# Altium schematic sheet Power.SchDoc
size 279 x 248 mm
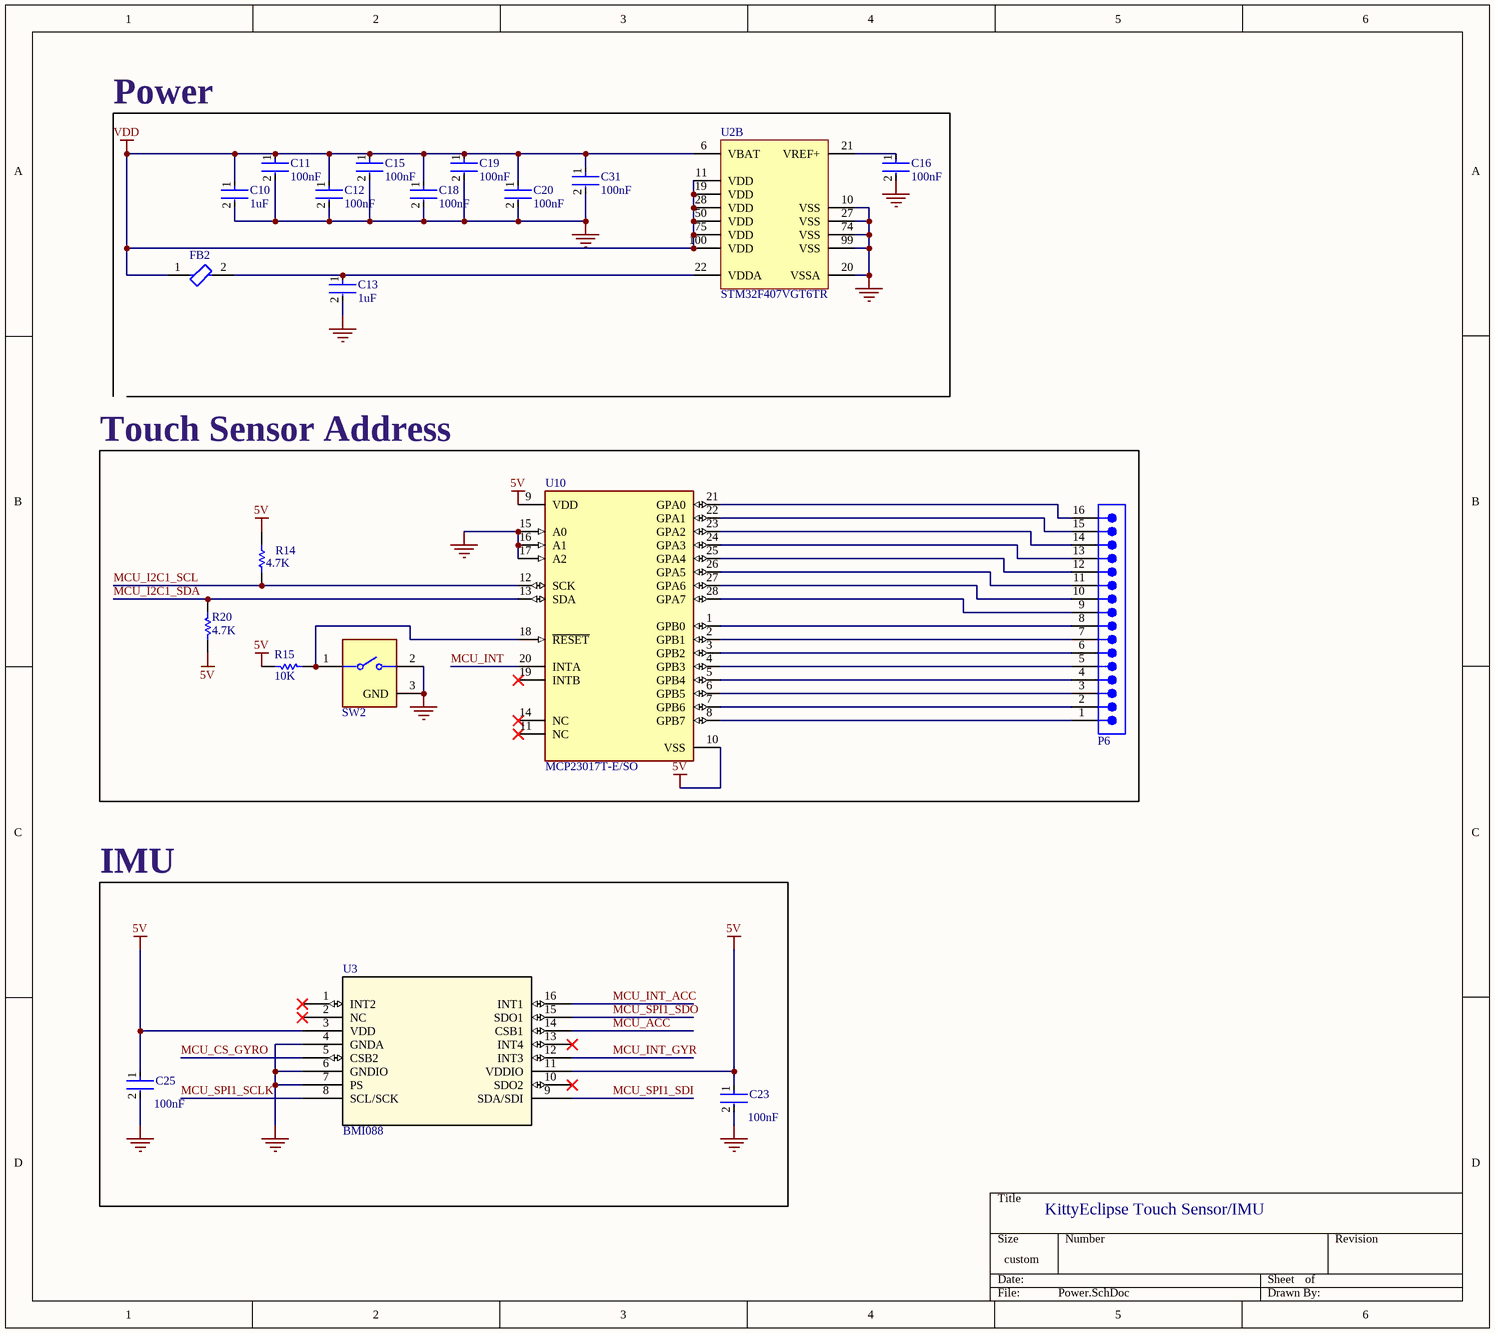
[diagram p0: Power.SchDoc]

## Parts
C10  1uF  [FP-CL10-IPC_C]
C11  100nF  [FP-CL93-IPC_C]
C12  100nF  [FP-CL93-IPC_C]
C13  1uF  [FP-CL10-IPC_C]
C15  100nF  [FP-CL93-IPC_C]
C16  100nF  [FP-CL93-IPC_C]
C18  100nF  [FP-CL93-IPC_C]
C19  100nF  [FP-CL93-IPC_C]
C20  100nF  [FP-CL93-IPC_C]
C23  100nF  [FP-CL93-IPC_C]
C25  100nF  [FP-CL93-IPC_C]
C31  100nF  [FP-CL93-IPC_C]
FB2  600ohm  [FP-BLM15-0_05-MFG]  (value not drawn)
P6  61301611121  [61301611121]  (value not drawn)
R14  4.7K  [RESC1608X55X25LL10T15]
R15  10K  [RESC1608X55X25ML10T15]
R20  4.7K  [RESC1608X55X25LL10T15]
SW2  B3U-1100PM  [FP-B3U-1100PM-MFG]  (value not drawn)
U2  STM32F407VGT6TR  [STM-LQFP100_L]  (part B of 2)
U3  BMI088  [QFN_BMI085_BOS]
U10  MCP23017T-E/SO  [FP-C04-052-MFG]

## Blocks framed on the sheet
Touch Sensor Address: P6 R14 R15 R20 SW2 U10
IMU: C23 C25 U3

## Nets
5V: C23.1 C25.1 R14.1 R15.1 R20.1 U3.3(VDD) U3.11(VDDIO) U10.9(VDD) U10.10(VSS)
GND: C10.2 C11.2 C12.2 C13.2 C15.2 C16.2 C18.2 C19.2 C20.2 C23.2 C25.2 C31.2 SW2.2 SW2.3(GND) U2.10(VSS) U2.20(VSSA) U2.27(VSS) U2.74(VSS) U2.99(VSS) U3.4(GNDA) U3.6(GNDIO) U3.7(PS) U10.15(A0) U10.16(A1) U10.17(A2)
VDD: C10.1 C11.1 C12.1 C15.1 C18.1 C19.1 C20.1 C31.1 FB2.1 U2.6(VBAT) U2.11(VDD) U2.19(VDD) U2.28(VDD) U2.50(VDD) U2.75(VDD) U2.100(VDD)
MCU_ACC: U3.14(CSB1)
MCU_CS_GYRO: U3.5(CSB2)
MCU_I2C1_SCL: R14.2 U10.12(SCK)
MCU_I2C1_SDA: R20.2 U10.13(SDA)
MCU_INT: U10.20(INTA)
MCU_INT_ACC: U3.16(INT1)
MCU_INT_GYR: U3.12(INT3)
MCU_SPI1_SCLK: U3.8(SCL/SCK)
MCU_SPI1_SDI: U3.9(SDA/SDI)
MCU_SPI1_SDO: U3.15(SDO1)
NetC13_1: C13.1 FB2.2 U2.22(VDDA)
NetC16_1: C16.1 U2.21(VREF+)
NetP6_1: P6.1 U10.8(GPB7)
NetP6_2: P6.2 U10.7(GPB6)
NetP6_3: P6.3 U10.6(GPB5)
NetP6_4: P6.4 U10.5(GPB4)
NetP6_5: P6.5 U10.4(GPB3)
NetP6_6: P6.6 U10.3(GPB2)
NetP6_7: P6.7 U10.2(GPB1)
NetP6_8: P6.8 U10.1(GPB0)
NetP6_9: P6.9 U10.28(GPA7)
NetP6_10: P6.10 U10.27(GPA6)
NetP6_11: P6.11 U10.26(GPA5)
NetP6_12: P6.12 U10.25(GPA4)
NetP6_13: P6.13 U10.24(GPA3)
NetP6_14: P6.14 U10.23(GPA2)
NetP6_15: P6.15 U10.22(GPA1)
NetP6_16: P6.16 U10.21(GPA0)
NetR15_2: R15.2 SW2.1 U10.18(~{RESET})

Not connected (* = marked no-connect by the designer): U3 1(INT2)* 2(NC)* 10(SDO2)* 13(INT4)*; U10 11(NC)* 14(NC)* 19(INTB)*

## Notes on the sheet
- Power
- KittyEclipse Touch Sensor/IMU

## Library data of the parts
C10 C13 = CMP-2000-06094-2: Cap Ceramic 1uF 10V X7R ±10% Pad SMD 0603 +125°C T/R; Packaging: Tape and Reel; Depth: 0.8mm; Voltage Rating: 10V; Lead Free: Lead Free; Radiation Hardening: No; Capacitance: 1uF; Length: 1.6mm; Package Quantity: 1; Mount: Surface Mount; Case/Package: 0603; Max Operating Temperature: 125°C; Case Code (Metric): 1608; Height: 0.8mm; Min Operating Temperature: -55°C; Dielectric: X7R; Contact Plating: Tin; Case Code (Imperial): 0603; Thickness: 0.035inch; Voltage Rating (DC): 10V; Tolerance: 10%; Width: 0.031inch
C11 C12 C15 C16 C18-C20 C23 C25 C31 = CMP-13271-000610-1: Cap Ceramic 100nF 10V X7R ±10% SMD 0402 +125°C Paper T/R
FB2 = CMP-0686-00187-4: Chip Ferrite Bead, 0402, 600Ω @ 100MHz, 0.52Ω, 25%, 300mA; DC Resistance-Max: 600mR; Number of Lines: 1; DC Resistance (DCR): 520mR; Shielding: Unshielded; Impedance: 600R; Material: Steel; Frequency: 100MHz; Lead Free: Lead Free; Max DC Current: 300mA; Test Frequency: 100MHz; Depth: 0.55mm; Length: 1mm; Case Code (Imperial): 0402; Packaging: Tape and Reel; Height: 0.5mm; Max Operating Temperature: 125°C; Military Standard: Not; REACH SVHC: No SVHC; Case Code (Metric): 1005; Series: BLM15AG_SN; Core Material: Ferrite; Termination: SMD/SMT; DC Current: 300mA; Package Quantity: 10000; Width: 0.5mm; RoHS Compliant: Yes; Min Operating Temperature: -55°C; Current Rating: 300mA; Case/Package: 0402; Number of Pins: 2; Radiation Hardening: No; Tolerance: 25%; Number of Circuits: 1; Max Current Rating: 300mA
P6 = CMP-1502-01095-4: NexarPartId: 32855548; Voltage Rating: 250V; Connector Type: Male Pin; Current Rating: 3A; Contact Resistance: 20mΩ; Number of Contacts: 16; Gender: Male; Pitch: 2.54mm; Min Operating Temperature: -40°C; Termination: Solder; Height: 8.89mm; Contact Plating: Gold; Packaging: Bulk; Contact Material: Copper; Mount: Through Hole; Number of Rows: 1; Contact Mating Length: 5.9944mm; Operating Supply Voltage: 250V; RoHS: Compliant; Max Operating Temperature: 105°C; Lead Pitch: 2.54mm; Color: Black; Number of Pins: 16; Number of Positions: 16; REACH SVHC: Unknown; Orientation: Vertical
R14 R20 = CMP-2000-06942-1: Chip Resistor, 4.7 KOhm, +/- 1%, 0.1 W, -55 to 155 degC, 0603 (1608 Metric), RoHS, Tape and Reel; Manufacturer: Yageo; Power Rating: 100mW; Temperature Coefficient: 100PPM/C; Resistance: 4.7kOhms; Voltage Rating: 50V; Package Reference: 0603; Series: RC; Datasheet Version: Rev. 7, 05/2017; Packaging: Reel; Termination Style: SMD/SMT; Datasheet URL: http://www.yageo.com/documents/recent/PYu-RC_Group_51_RoHS_L_7.pdf; Manufacturer URL: http://www.yageo.com/; Package Description: 2-Pin Surface Mount Device, Body 1.6 x 0.8 mm; Case Code - mm: 1608; Case Code - in: 0603; Mounting Technology: SurfaceMount; Operating Temperature Range: -55Cto+155C; Tolerance: 1%; Product: ThickFilmResistorsGeneralPurpose
R15 = CMP-2000-05022-1: Resistor, 10 KOhm, +/- 5%, 100 mW, -55 to 155 degC, 0603 (1608 Metric), RoHS, Tape and Reel; Manufacturer: Yageo; Resistance: 10kOhms; Voltage Rating: 50V; Temperature Coefficient: 100PPM/C; Power Rating: 100mW; Package Reference: 603; Series: RC; Case Code - mm: 1608; Packaging: Reel; Datasheet URL: http://www.farnell.com/datasheets/443971.pdf; Datasheet Version: Rev. 4, 04/2009; Operating Temperature Range: -55Cto+155C; Product: ThickFilmResistorsGeneralPurpose; Package Description: 2-Pin Surface Mount Device, Body 1.6 x 0.8 mm; Manufacturer URL: http://www.yageo.com/; Case Code - in: 0603; Tolerance: 5%; Termination Style: SMD/SMT
SW2 = CMP-08834-000028-1: SWITCH TACTILE SPST-NO 0.05A 12V; Switch Travel: 0.15mm; Throw Configuration: SPST; Current Rating: 50mA; Illumination Type: Non-Illuminated; Actuator Length: 0.4mm; Operating Force: 1.5N; Connector Type: SMD/SMT; Contact Resistance: 100mR; Actuator Type: Standard; Electrical Life: 200000Cycles; Switch Function: Off-Mom; Ratings: Dust Proof; Max Operating Temperature: 70°C; Weight: 0.022g; Series: B3U; Min Operating Temperature: -25°C; Voltage Rating (DC): 12V; Orientation: Straight; Package Quantity: 1000; Packaging: Tape and Reel; RoHS Compliant: Yes; REACH SVHC: No SVHC; Max Voltage Rating (DC): 12V; Mount: Surface Mount; Case/Package: SMD/SMT; Mechanical Life: 200000Cycles; Termination: SMD/SMT
U2 = CMP-0243-00033-2: ARM Cortex-M4 32-bit MCU+FPU, 210 DMIPS, 1024 kB Flash, 192 kB Internal RAM, 82 I/Os, 100-pin LQFP, -40 to 85 degC, Tape and Reel; Manufacturer: STMicroelectronics; Supply Voltage(Vcc) max (V): 3.6; Supply Voltage(Vcc) min (V): 1.8; D/A Converter: 2x12-bit; I/Os (High Current): 82; Operating Frequency(F) (Processor speed) (MHz): 168; FLASH Size (Prog) (kB): 1024; Internal RAM Size (kB): 192; ComponentLink1Description: Manufacturer URL; PackageDescription: 100-Pin Low Profile Quad Flat Package, 14 x 14 mm Body, 0.5 mm Pitch; DatasheetVersion: Rev. 4; ComponentLink1URL: http://www.st.com/web/en/home.html; Mounting Technology: Surface Mount; ComponentLink3URL: http://www.st.com/st-web-ui/static/active/en/resource/technical/document/data_brief/DM00071938.pdf; PartNumber: STM32F407VGT6TR; ComponentLink2URL: http://www.st.com/st-web-ui/static/active/en/resource/technical/document/datasheet/DM00037051.pdf; Packing: Tape and Reel; ComponentLink2Description: Datasheet; PackageReference: LQFP100; ComponentLink3Description: Package Specification; PackageVersion: Rev. 1, 06/2013; Core: ARM Cortex-M4
U3 = BMI088: No Description Available; Mfr_Name: Bosch Sensortec; RefDes: RefDes; Type: Type
U10 = CMP-0186-00060-3: IC I/O EXPANDER I2C 16B 28SOIC; Number of Channels: 1; Operating Supply Voltage: 5.5V; Max Frequency: 1.7MHz; Nominal Supply Current: 1mA; Number of Bits: 16; Interface: I2C; Number of Pins: 28; Max Operating Temperature: 125°C; Packaging: Tape and Reel; Case/Package: SOIC; Package Quantity: 1600; Min Operating Temperature: -40°C; Lead Free: Lead Free; Frequency: 1.7MHz; Number of I/Os: 16